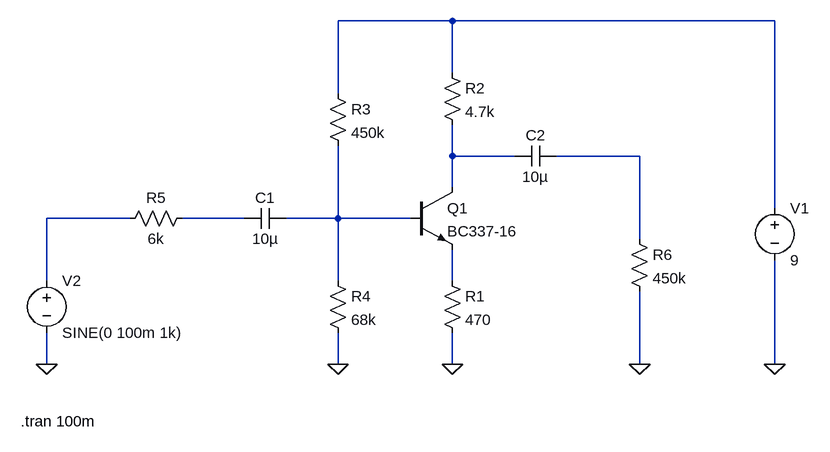
[diagram p0: schematic klasa_A.asc]
klasa_A.asc, the LTspice schematic file:
Version 4
SHEET 1 880 680
WIRE 176 -128 0 -128
WIRE 672 -128 176 -128
WIRE 176 -48 176 -128
WIRE 0 -16 0 -128
WIRE 176 80 176 32
WIRE 272 80 176 80
WIRE 464 80 336 80
WIRE 176 128 176 80
WIRE 672 160 672 -128
WIRE -320 176 -448 176
WIRE -144 176 -240 176
WIRE 0 176 0 64
WIRE 0 176 -80 176
WIRE 112 176 0 176
WIRE 464 208 464 80
WIRE -448 272 -448 176
WIRE 0 272 0 176
WIRE 176 272 176 224
WIRE -448 400 -448 352
WIRE 0 400 0 352
WIRE 176 400 176 352
WIRE 464 400 464 288
WIRE 672 400 672 240
FLAG -448 400 0
FLAG 0 400 0
FLAG 176 400 0
FLAG 464 400 0
FLAG 672 400 0
SYMBOL npn 112 128 R0
SYMATTR InstName Q1
SYMATTR Value BC337-16
SYMBOL res 160 256 R0
SYMATTR InstName R1
SYMATTR Value 470
SYMBOL res 160 -64 R0
SYMATTR InstName R2
SYMATTR Value 4.7k
SYMBOL res -16 -32 R0
SYMATTR InstName R3
SYMATTR Value 450k
SYMBOL res -16 256 R0
SYMATTR InstName R4
SYMATTR Value 68k
SYMBOL cap -80 160 R90
WINDOW 0 0 32 VBottom 2
WINDOW 3 32 32 VTop 2
SYMATTR InstName C1
SYMATTR Value 10µ
SYMBOL res -224 160 R90
WINDOW 0 0 56 VBottom 2
WINDOW 3 32 56 VTop 2
SYMATTR InstName R5
SYMATTR Value 6k
SYMBOL voltage 672 144 R0
WINDOW 123 0 0 Left 0
WINDOW 39 0 0 Left 0
SYMATTR InstName V1
SYMATTR Value 9
SYMBOL voltage -448 256 R0
WINDOW 123 0 0 Left 0
WINDOW 39 0 0 Left 0
SYMATTR InstName V2
SYMATTR Value SINE(0 100m 1k)
SYMBOL cap 336 64 R90
WINDOW 0 0 32 VBottom 2
WINDOW 3 32 32 VTop 2
SYMATTR InstName C2
SYMATTR Value 10µ
SYMBOL res 448 192 R0
SYMATTR InstName R6
SYMATTR Value 450k
TEXT -488 488 Left 2 !.tran 100m

The netlist it stands for:
* klasa_A.asc
Q1 N002 N006 N007 0 BC337-16
R1 N007 0 470
R2 N001 N002 4.7k
R3 N001 N006 450k
R4 N006 0 68k
C1 N006 N005 10µ
R5 N005 N004 6k
V1 N001 0 9
V2 N004 0 SINE(0 100m 1k)
C2 N003 N002 10µ
R6 N003 0 450k
.model NPN NPN
.model PNP PNP
.lib standard.bjt
.tran 100m
.backanno
.end